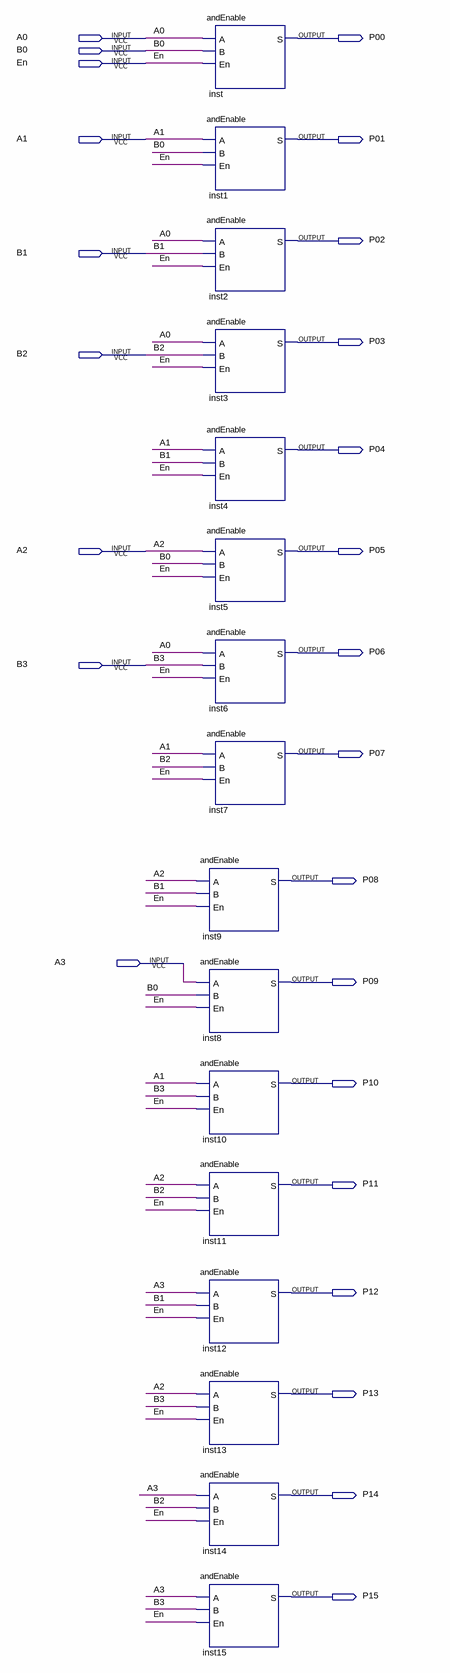
[diagram p0: schematic sheet]
// Quartus schematic Parciais.bdf as structural Verilog: 16 symbols, 25 pins
module Parciais (
  input  A0,
  input  B0,
  input  En,
  input  A1,
  input  B1,
  input  B2,
  input  A2,
  input  B3,
  input  A3,
  output P00,
  output P01,
  output P02,
  output P03,
  output P04,
  output P05,
  output P06,
  output P07,
  output P08,
  output P09,
  output P10,
  output P11,
  output P12,
  output P13,
  output P14,
  output P15
);

  andEnable inst9 (.A(A2), .B(B1), .En(En), .S(P08));
  andEnable inst8 (.A(A3), .B(B0), .En(En), .S(P09));
  andEnable inst10 (.A(A1), .B(B3), .En(En), .S(P10));
  andEnable inst11 (.A(A2), .B(B2), .En(En), .S(P11));
  andEnable inst12 (.A(A3), .B(B1), .En(En), .S(P12));
  andEnable inst13 (.A(A2), .B(B3), .En(En), .S(P13));
  andEnable inst14 (.A(A3), .B(B2), .En(En), .S(P14));
  andEnable inst15 (.A(A3), .B(B3), .En(En), .S(P15));
  andEnable inst (.A(A0), .B(B0), .En(En), .S(P00));
  andEnable inst1 (.A(A1), .B(B0), .En(En), .S(P01));
  andEnable inst2 (.A(A0), .B(B1), .En(En), .S(P02));
  andEnable inst3 (.A(A0), .B(B2), .En(En), .S(P03));
  andEnable inst4 (.A(A1), .B(B1), .En(En), .S(P04));
  andEnable inst5 (.A(A2), .B(B0), .En(En), .S(P05));
  andEnable inst6 (.A(A0), .B(B3), .En(En), .S(P06));
  andEnable inst7 (.A(A1), .B(B2), .En(En), .S(P07));
endmodule
